# Altium project Pulse_Ox.PrjPcb
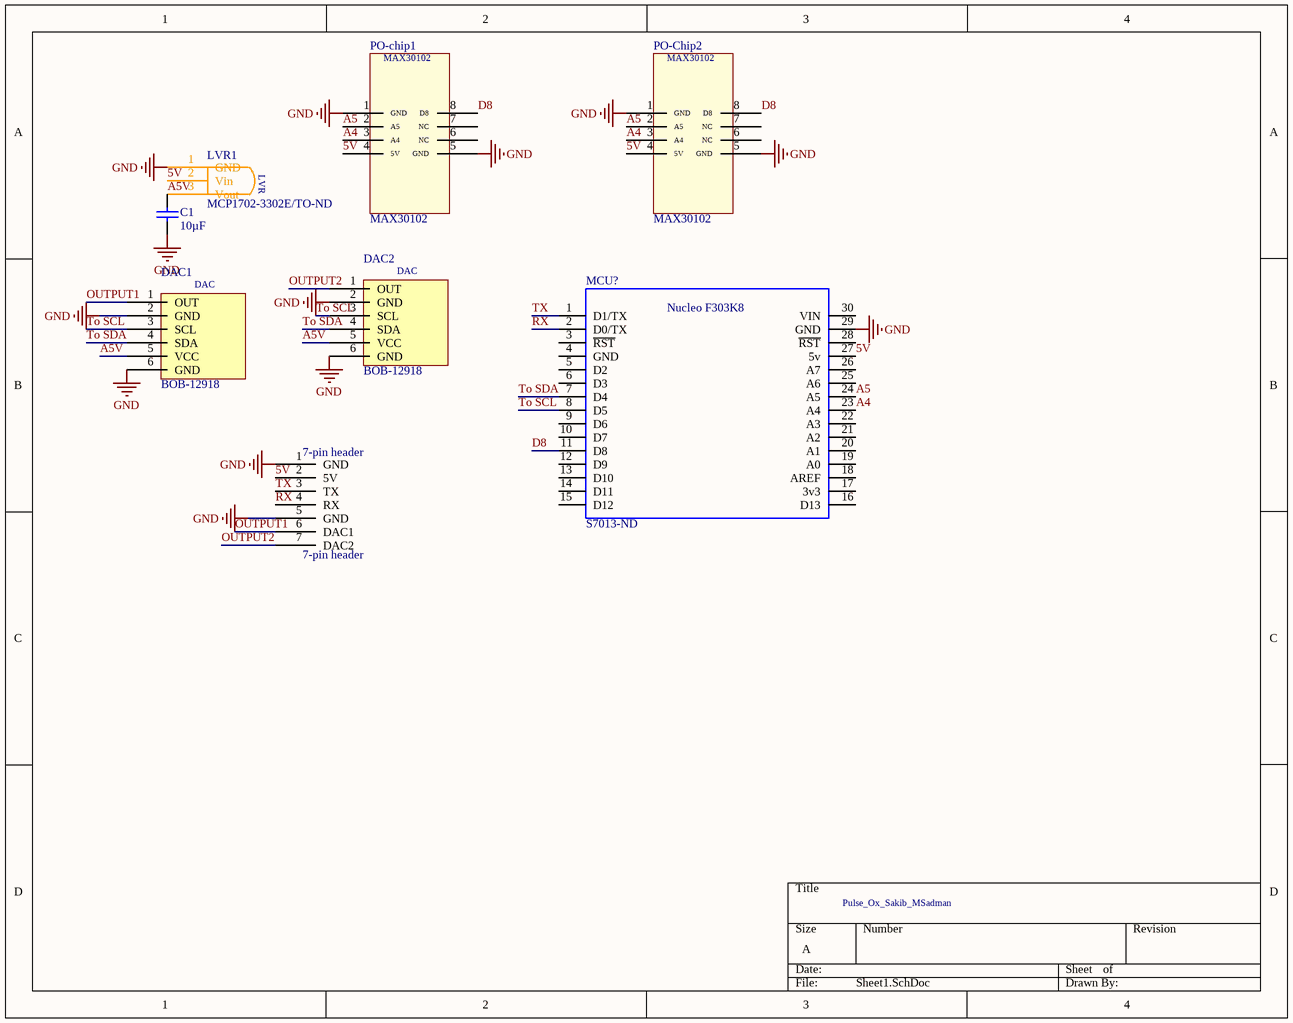
[diagram p0: Sheet1.SchDoc]
1 sheet, 8 parts. Net scope: global (net labels, ports and power ports of the same name join across sheets).
Board file: PCB1.PcbDoc

## Sheet Sheet1.SchDoc
size A; SheetNumber: 1; SheetTotal: 1

### Parts
7-pin_header  7-pin header  [7 pin header]
C1  Capacitance: 10µF  [Capacitor]  (hidden comment: Cap-10u)
DAC1  BOB-12918  [BOB-12918]
DAC2  BOB-12918  [BOB-12918]
LVR1  MCP1702-3302E/TO-ND  [MCP1702-3302E/TO-ND_1]
MCU?  Supplier Part Number 1: S7013-ND  [Nucleo_Given]  (hidden comment: Nucleo F303K8_FINISHED)
PO-chip1  MAX30102  [MAX30102]
PO-Chip2  MAX30102  [MAX30102]

### Nets
GND: 7-pin_header.1(GND) 7-pin_header.5(GND) C1.1 DAC1.2(GND) DAC1.6(GND) DAC2.2(GND) DAC2.6(GND) LVR1.1(GND) MCU?.29(GND) PO-chip1.1(GND) PO-chip1.5(GND) PO-Chip2.1(GND) PO-Chip2.5(GND)
5V: 7-pin_header.2(5V) LVR1.2(Vin) MCU?.27(5v) PO-chip1.4(5V) PO-Chip2.4(5V)
A4: MCU?.23(A4) PO-chip1.3(A4) PO-Chip2.3(A4)
A5: MCU?.24(A5) PO-chip1.2(A5) PO-Chip2.2(A5)
A5V: C1.2 DAC1.5(VCC) DAC2.5(VCC) LVR1.3(Vout)
D8: MCU?.11(D8) PO-chip1.8(D8) PO-Chip2.8(D8)
OUTPUT1: 7-pin_header.6(DAC1) DAC1.1(OUT)
OUTPUT2: 7-pin_header.7(DAC2) DAC2.1(OUT)
RX: 7-pin_header.4(RX) MCU?.2(D0/TX)
To SCL: DAC1.3(SCL) DAC2.3(SCL) MCU?.8(D5)
To SDA: DAC1.4(SDA) DAC2.4(SDA) MCU?.7(D4)
TX: 7-pin_header.3(TX) MCU?.1(D1/TX)

Not connected (* = marked no-connect by the designer): MCU? 3(~{RST}) 4(GND) 5(D2) 6(D3) 9(D6) 10(D7) 12(D9) 13(D10) 14(D11) 15(D12) 16(D13) 17(3v3) 18(AREF) 19(A0) 20(A1) 21(A2) 22(A3) 25(A6) 26(A7) 28(~{RST}) 30(VIN); PO-chip1 6(NC) 7(NC); PO-Chip2 6(NC) 7(NC)

### Notes on the sheet
- Pulse_Ox_Sakib_MSadman
- (in symbol BOB-12918) DAC
- (in symbol MCP1702-3302E/TO-ND) LVR

### Library data of the parts
C1 = Cap-10u: Manufacturer: TDK Corporation; Manufacturer Part Number: FK26X7R1C106K; Tolerance: ±10%; Voltage - Rated: 16V; Temperature Coefficient: X7R; Supplier 1: Digi-Key; RoHS: RoHS Compliant; Category: Capacitors; Stock 1: 7933; Pricing 1: 1=0.45, 10=0.319, 100=0.2101, 250=0.17896, 500=0.1556, 1000=0.13226, 5000=0.1167, 10000=0.10892, 25000=0.10503 (USD); Packaging: Bulk; Mounting Type: Through Hole; Operating Temperature: -55°C ~ 125°C; Applications: General Purpose; Ratings: -; Package / Case: Radial; Size / Dimension: 0.217" L x 0.138" W (5.50mm x 3.50mm); Height - Seated (Max): 0.236" (6.00mm); Thickness (Max): -; Lead Spacing: 0.197" (5.00mm); Features: -; Lead Style: Formed Leads - Kinked; ComponentLink1URL: https://product.tdk.com/info/en/documents/catalog/leadmlcc_conventional_fk_en.pdf; ComponentLink1Description: https://product.tdk.com/info/en/documents/catalog/leadmlcc_conventional_fk_en.pdf; Supplier Part Number 1: 445-8549-ND
MCU? = Nucleo F303K8_FINISHED: Nucleo F303K8; Manufacturer: Sullins Connector Solutions; Manufacturer Part Number: PPTC151LFBN-RC; Connector Type: Header; Style: Board to Board; Number of Positions: 15; Number of Positions Loaded: All; Pitch - Mating: 0.100" (2.54mm); Contact Length - Post: 0.126" (3.20mm); Material Flammability Rating: UL94 V-0; Current Rating: 3A; Voltage Rating: 250V; RoHS: RoHS Compliant; Category: Connectors, Interconnects; Packaging: Bulk; Part Status: Active; Contact Type: Female Socket; Number of Rows: 1; Row Spacing - Mating: -; Mounting Type: Through Hole; Termination: Solder; Fastening Type: Push-Pull; Contact Finish - Mating: Tin; Contact Finish Thickness - Mating: -; Insulation Color: Black; Insulation Height: 0.335" (8.51mm); Operating Temperature: -40°C ~ 105°C; Contact Finish - Post: Tin; Mated Stacking Heights: -; Ingress Protection: -; Features: -; Applications: -; Insulation Material: Polyester; Contact Shape: Square; Contact Material: Phosphor Bronze; Contact Finish Thickness - Post: -; ComponentLink1URL: http://www.sullinscorp.com/drawings/78_P(N)PxCxxxLFBN-RC,_10492-H.pdf; ComponentLink1Description: http://www.sullinscorp.com/drawings/78_P(N)PxCxxxLFBN-RC,_10492-H.pdf; Supplier 1: Digi-Key; Stock 1: 2938; Pricing 1: 1=1.22, 10=1.013, 25=0.9376, 50=0.8438, 100=0.75, 250=0.65624, 500=0.6, 1000=0.54375, 2500=0.4875 (USD)